# Altium schematic sheet Cover_Page.SchDoc: Audio EDU Mini
size A4; DrawnBy: Connor Dack; Engineer: Connor Dack; Revision: 0.0; SheetNumber: 1; SheetTotal: 7
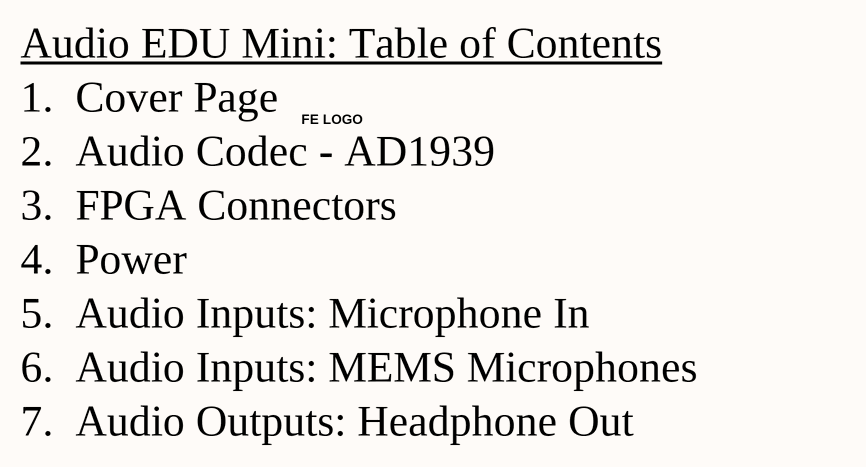
[diagram p0: Cover_Page.SchDoc]

## Parts
Logo1  FE_LOGO  [feLogo_small]  (value not drawn)  (no BOM)

## Notes on the sheet
- (near Logo1) Audio EDU Mini: Table of Contents
- (near Logo1) 1.  Cover Page
- 2.  Audio Codec - AD1939
- 3.  FPGA Connectors
- 4.  Power
- 5.  Audio Inputs: Microphone In
- 6.  Audio Inputs: MEMS Microphones
- 7.  Audio Outputs: Headphone Out
- Title:
- Sheet:
- of
- Size:
- A4
- Rev:
- Date:
- Engineer:
- Time:
- File:
- (in symbol FE_LOGO) FE LOGO

## Library data of the parts
Logo1 = FE_LOGO: FE LOGO in Copper; Load Status: Do Not Install